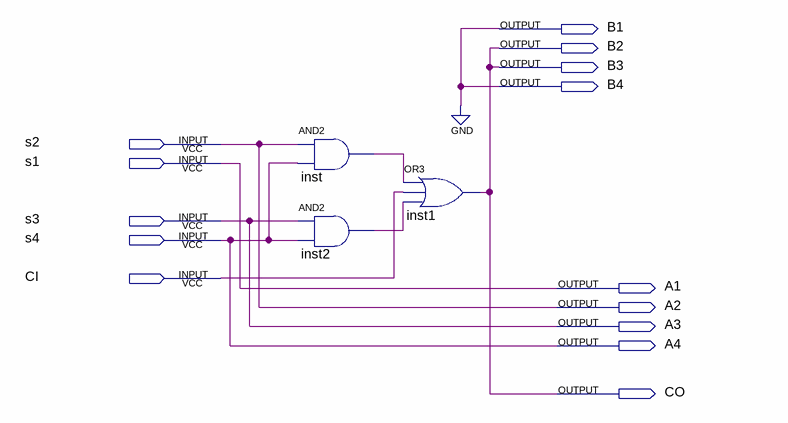
[diagram p0: schematic sheet]
// Quartus schematic LHHL.bdf as structural Verilog: 3 symbols, 14 pins
module LHHL (
  input  s2,
  input  s1,
  input  s3,
  input  s4,
  input  CI,
  output B1,
  output B2,
  output B3,
  output B4,
  output A1,
  output A2,
  output A3,
  output A4,
  output CO
);

  wire inst2_out, inst_out;

  and inst (inst_out, s2, s4);
  and inst2 (inst2_out, s3, s4);
  or inst1 (B2, inst_out, CI, inst2_out);

  assign A1 = s1;
  assign A2 = s2;
  assign A3 = s3;
  assign A4 = s4;
  assign B1 = 1'b0;
  assign B3 = B2;
  assign B4 = 1'b0;
  assign CO = B2;
endmodule
